# EAGLE schematic bmc (EAGLE 9.6.1)
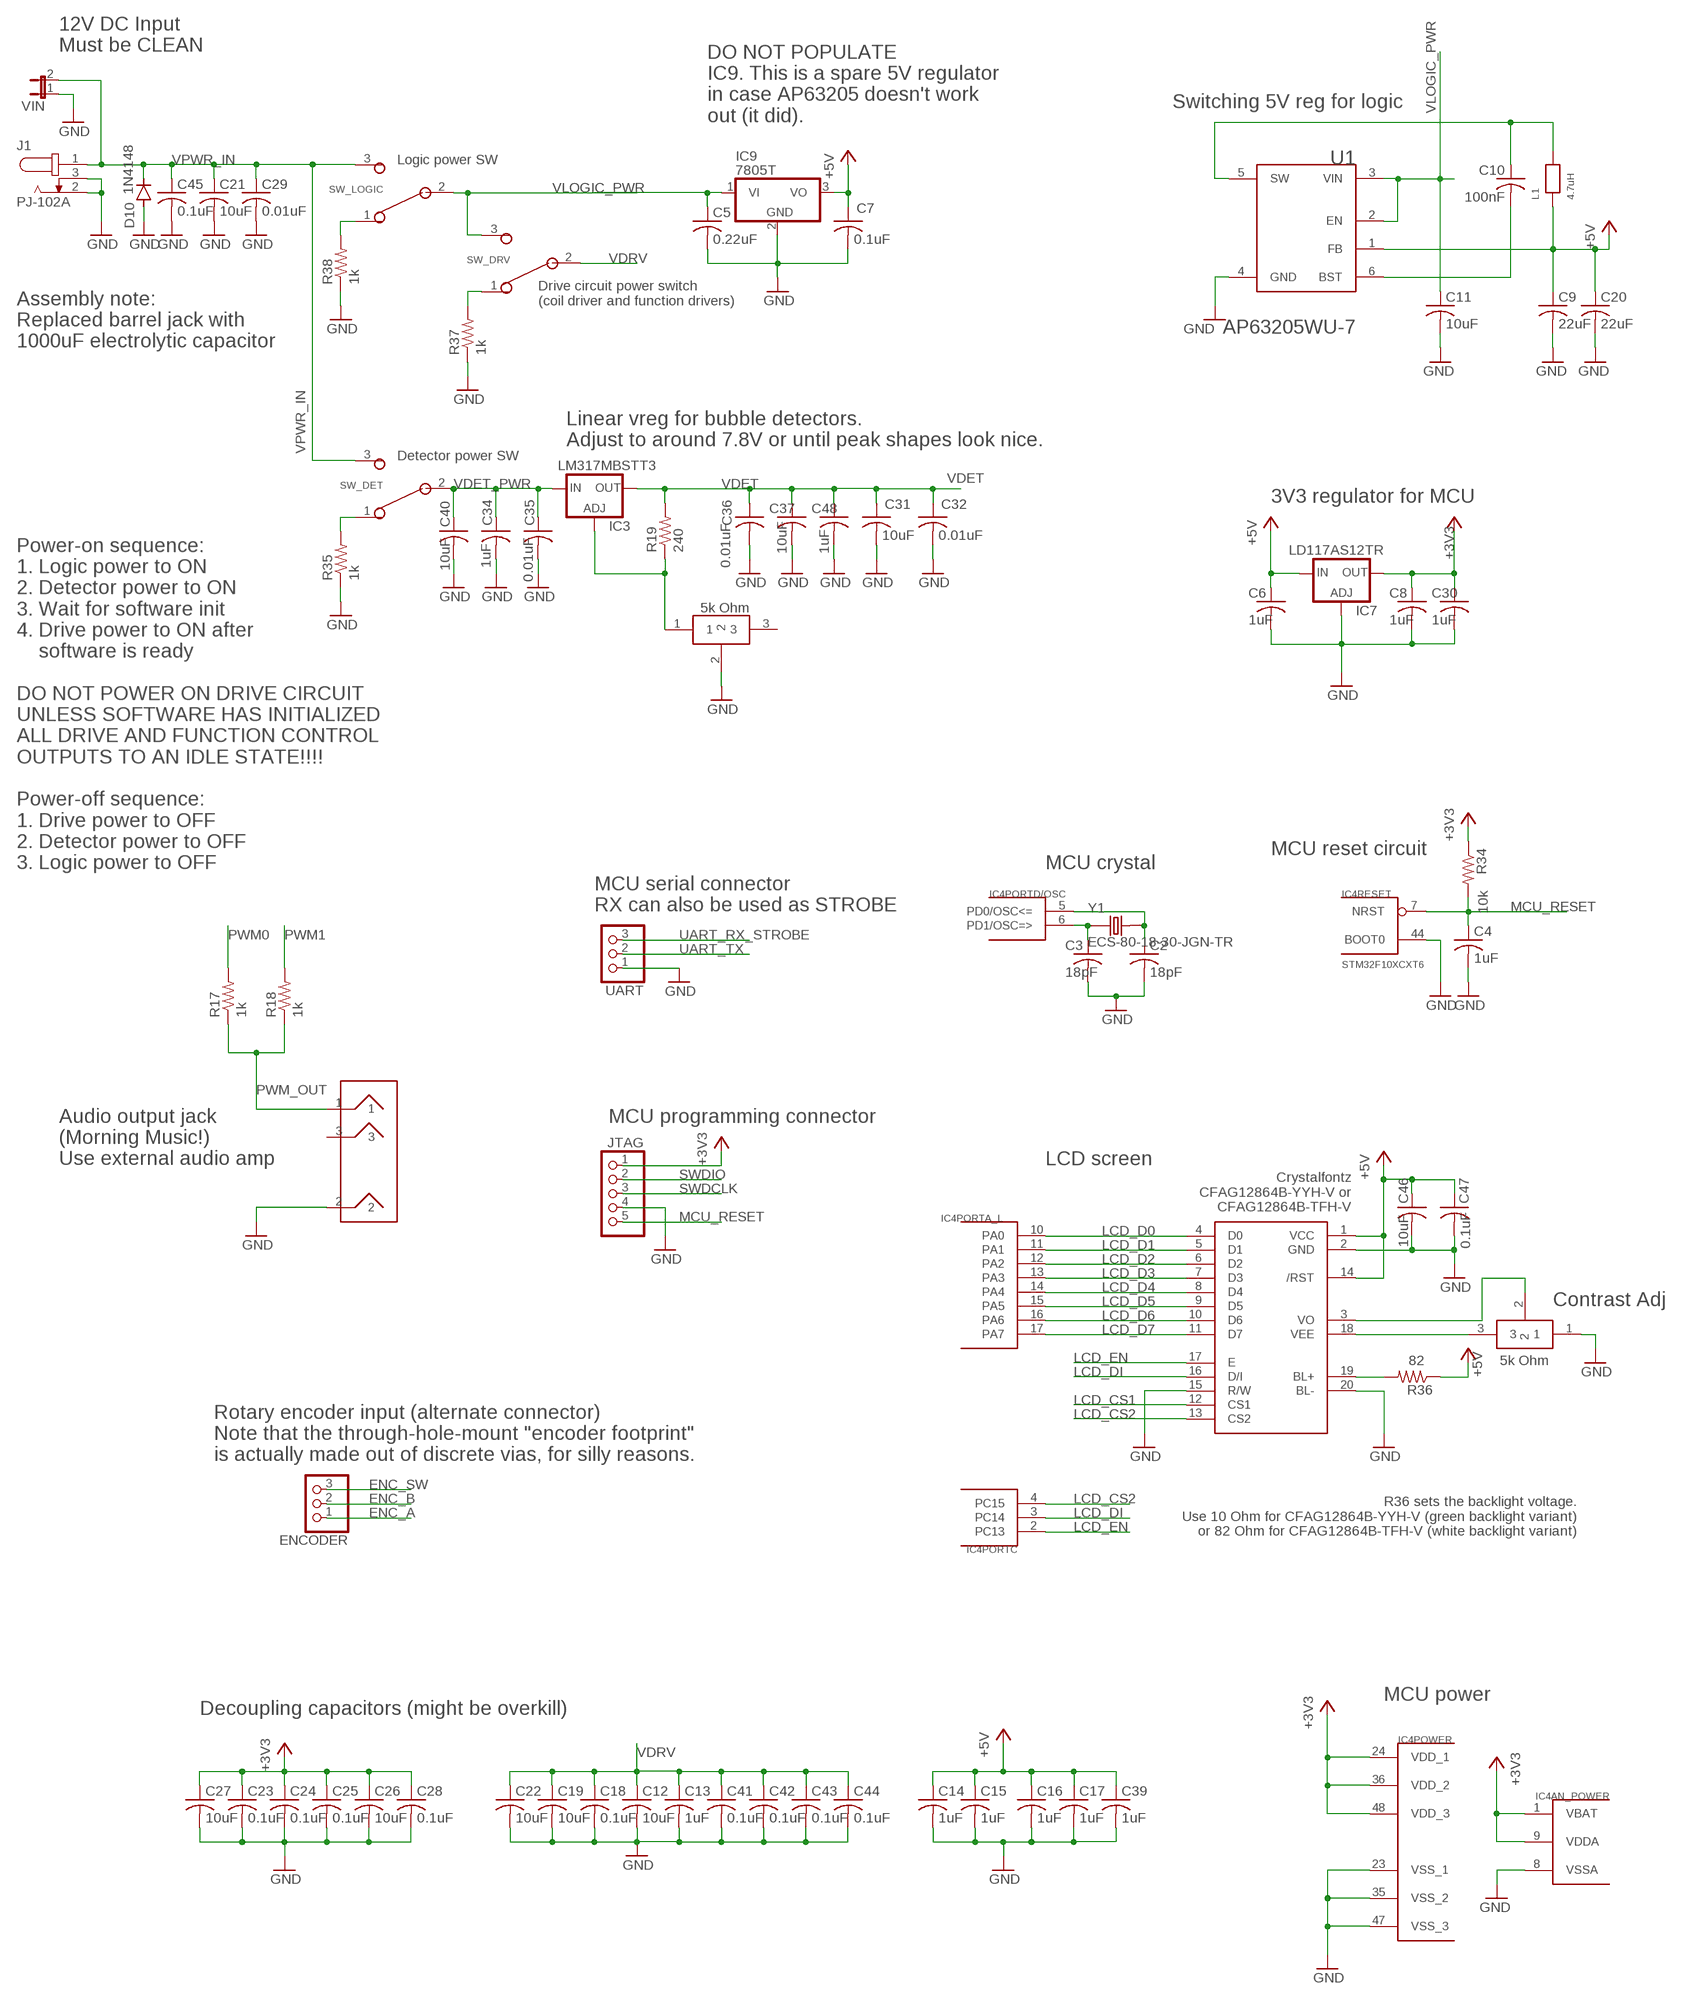
[diagram p0: schematic, sheet 1, part 1 of 2]
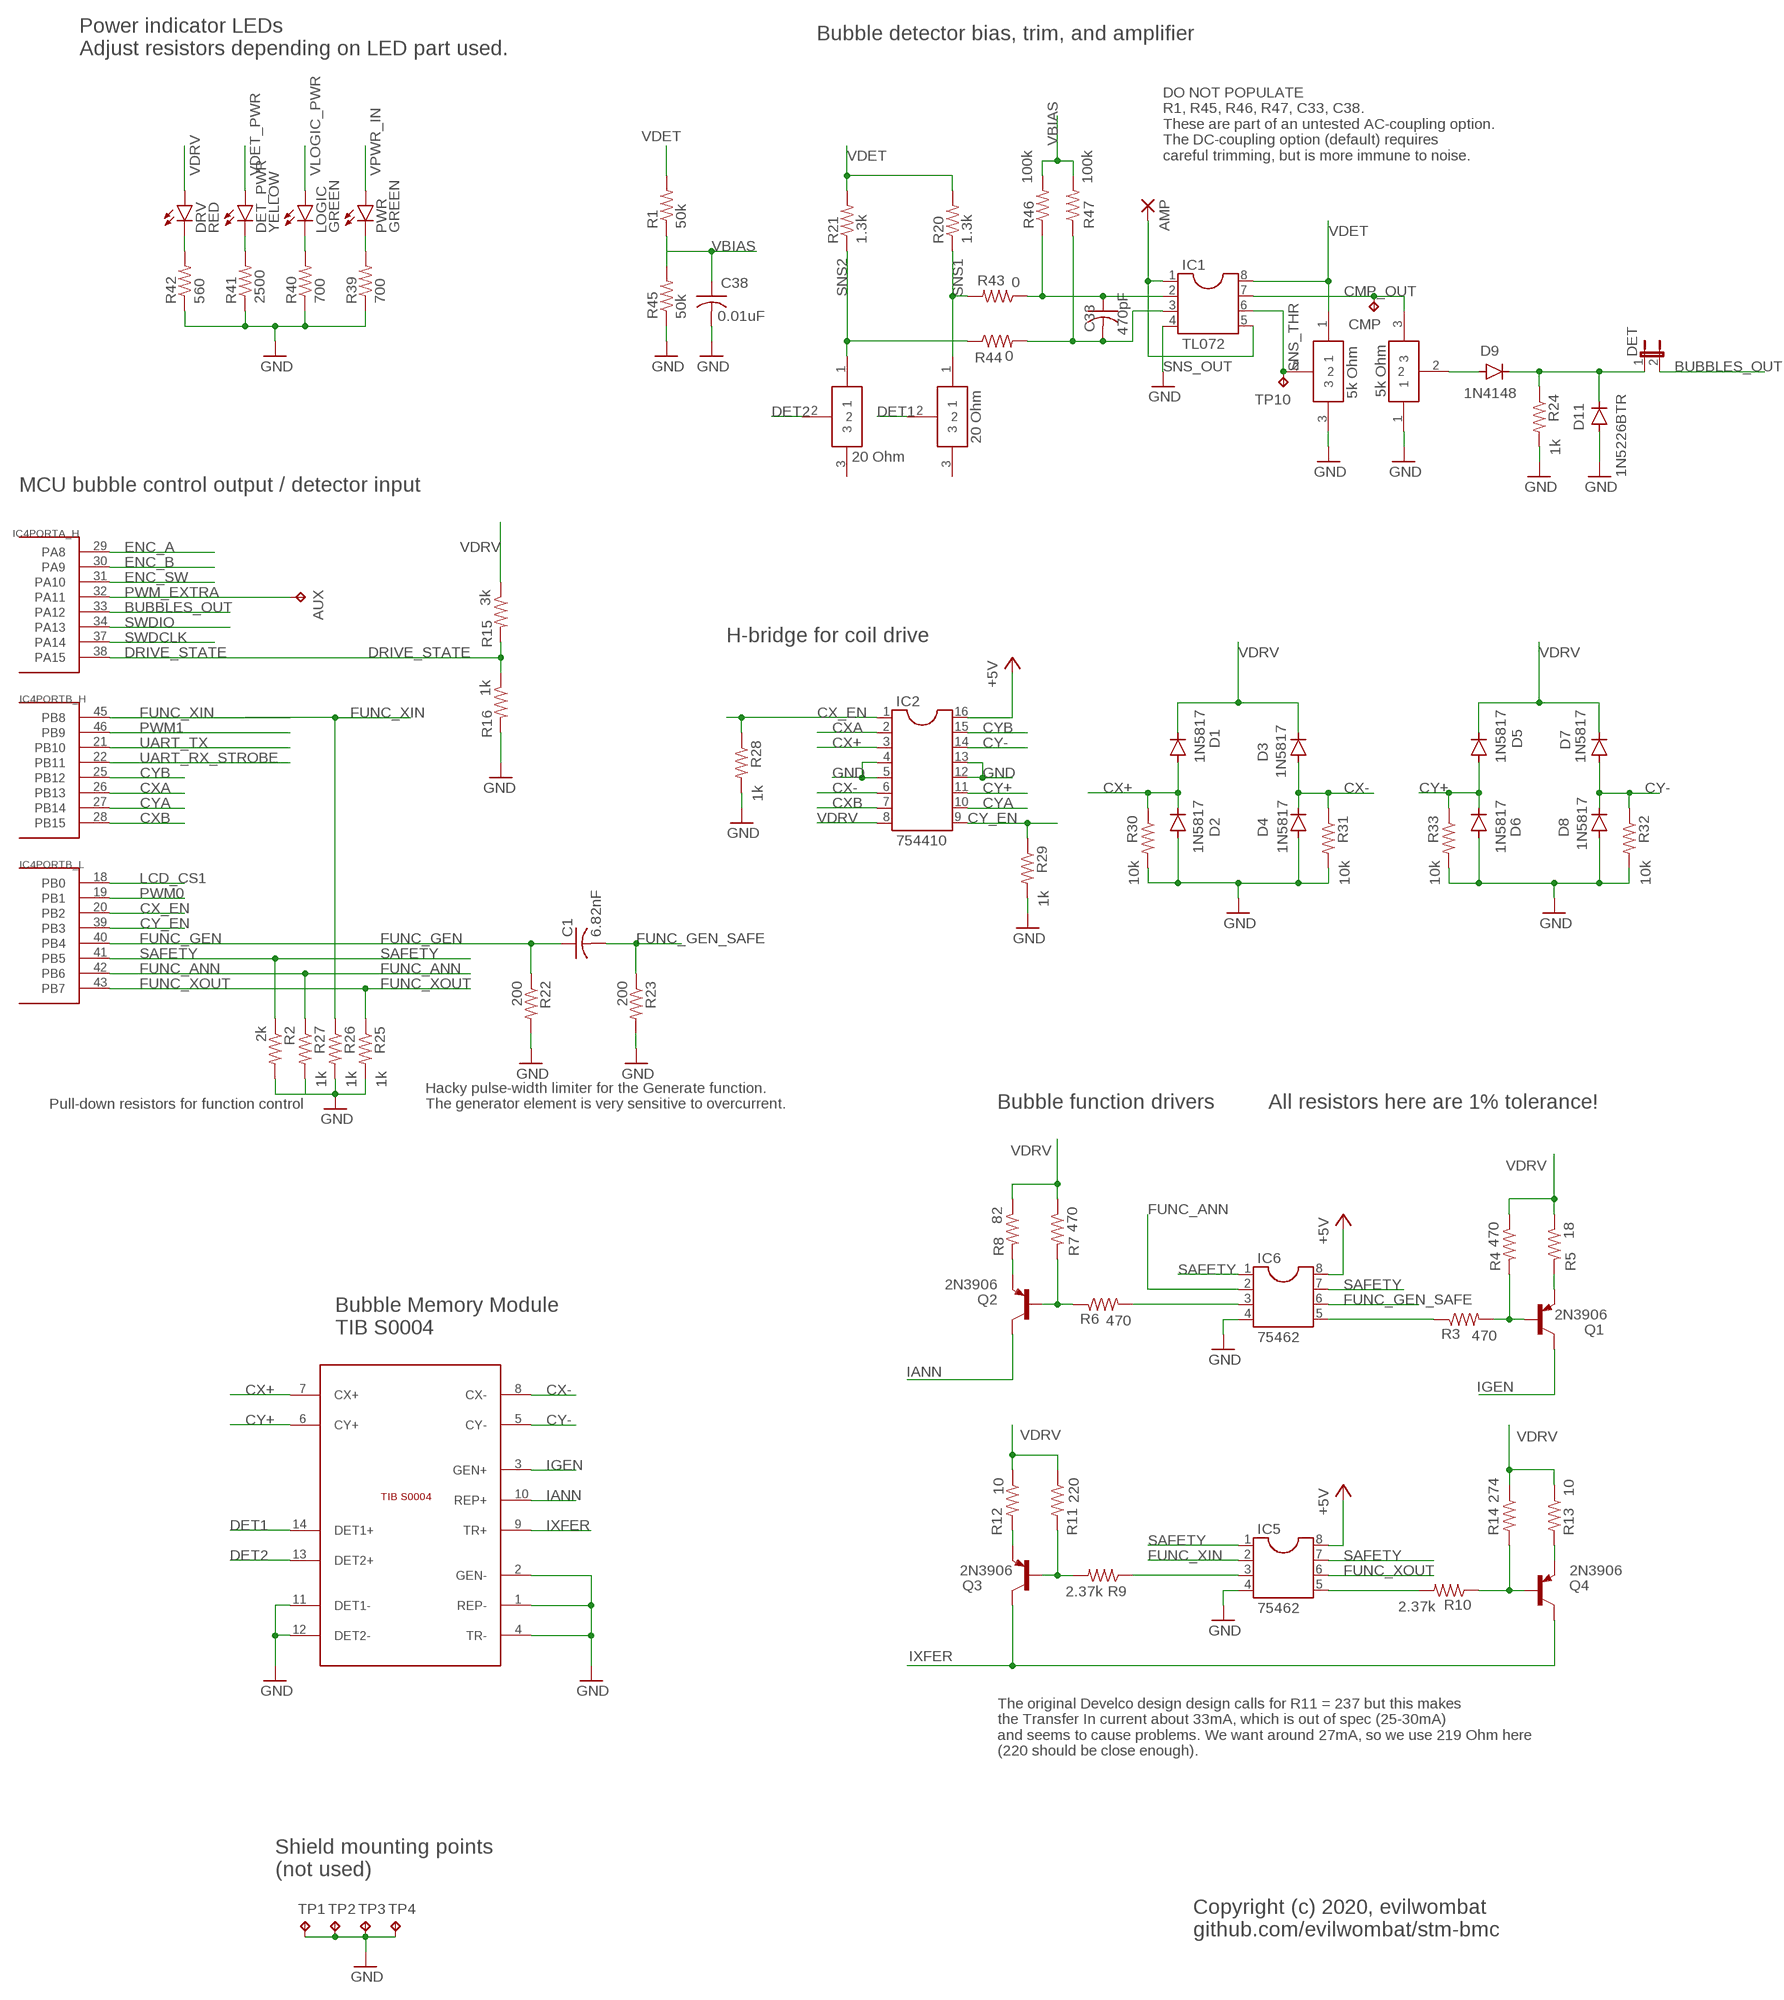
[diagram p1: schematic, sheet 1, part 2 of 2]

## Parts
AMP  1,6/0,8  [1,6/0,8]
AUX  TPTP07R  [TP07R]
C1  6.82nF  C-US_CHIP-0805(2012-METRIC)  [CAPC2012X110]
C2  18pF  C-US_CHIP-0805(2012-METRIC)  [CAPC2012X110]
C3  18pF  C-US_CHIP-0805(2012-METRIC)  [CAPC2012X110]
C4  1uF  C-US_CHIP-0805(2012-METRIC)  [CAPC2012X110]
C5  0.22uF  C-US_CHIP-0805(2012-METRIC)  [CAPC2012X110]
C6  1uF  C-US_CHIP-0805(2012-METRIC)  [CAPC2012X110]
C7  0.1uF  C-US_CHIP-0805(2012-METRIC)  [CAPC2012X110]
C8  1uF  C-US_CHIP-0805(2012-METRIC)  [CAPC2012X110]
C9  22uF  C-US_CHIP-0805(2012-METRIC)  [CAPC2012X110]
C10  100nF  C-US_CHIP-0805(2012-METRIC)  [CAPC2012X110]
C11  10uF  C-US_CHIP-1206(3216-METRIC)  [CAPC3216X135]
C12  10uF  C-US_CHIP-1206(3216-METRIC)  [CAPC3216X135]
C13  1uF  C-US_CHIP-0805(2012-METRIC)  [CAPC2012X110]
C14  1uF  C-US_CHIP-0805(2012-METRIC)  [CAPC2012X110]
C15  1uF  C-US_CHIP-0805(2012-METRIC)  [CAPC2012X110]
C16  1uF  C-US_CHIP-0805(2012-METRIC)  [CAPC2012X110]
C17  1uF  C-US_CHIP-0805(2012-METRIC)  [CAPC2012X110]
C18  0.1uF  C-US_CHIP-0805(2012-METRIC)  [CAPC2012X110]
C19  10uF  C-US_CHIP-1206(3216-METRIC)  [CAPC3216X135]
C20  22uF  C-US_CHIP-0805(2012-METRIC)  [CAPC2012X110]
C21  10uF  C-US_CHIP-1206(3216-METRIC)  [CAPC3216X135]
C22  10uF  C-US_CHIP-1206(3216-METRIC)  [CAPC3216X135]
C23  0.1uF  C-US_CHIP-0402(1005-METRIC)  [CAPC1005X60]
C24  0.1uF  C-US_CHIP-0402(1005-METRIC)  [CAPC1005X60]
C25  0.1uF  C-US_CHIP-0402(1005-METRIC)  [CAPC1005X60]
C26  10uF  C-US_CHIP-0805(2012-METRIC)  [CAPC2012X110]
C27  10uF  C-US_CHIP-0805(2012-METRIC)  [CAPC2012X110]
C28  0.1uF  C-US_CHIP-0402(1005-METRIC)  [CAPC1005X60]
C29  0.01uF  C-US_CHIP-0805(2012-METRIC)  [CAPC2012X110]
C30  1uF  C-US_CHIP-0805(2012-METRIC)  [CAPC2012X110]
C31  10uF  C-US_CHIP-1206(3216-METRIC)  [CAPC3216X135]
C32  0.01uF  C-US_CHIP-0805(2012-METRIC)  [CAPC2012X110]
C33  470pF  C-US_CHIP-0805(2012-METRIC)  [CAPC2012X110]
C34  1uF  C-US_CHIP-0805(2012-METRIC)  [CAPC2012X110]
C35  0.01uF  C-US_CHIP-0805(2012-METRIC)  [CAPC2012X110]
C36  0.01uF  C-US_CHIP-0805(2012-METRIC)  [CAPC2012X110]
C37  10uF  C-US_CHIP-1206(3216-METRIC)  [CAPC3216X135]
C38  0.01uF  C-US_CHIP-0805(2012-METRIC)  [CAPC2012X110]
C39  1uF  C-US_CHIP-0805(2012-METRIC)  [CAPC2012X110]
C40  10uF  C-US_CHIP-1206(3216-METRIC)  [CAPC3216X135]
C41  0.1uF  C-US_CHIP-0805(2012-METRIC)  [CAPC2012X110]
C42  0.1uF  C-US_CHIP-0805(2012-METRIC)  [CAPC2012X110]
C43  0.1uF  C-US_CHIP-0805(2012-METRIC)  [CAPC2012X110]
C44  0.1uF  C-US_CHIP-0805(2012-METRIC)  [CAPC2012X110]
C45  0.1uF  C-US_CHIP-0805(2012-METRIC)  [CAPC2012X110]
C46  10uF  C-US_CHIP-1206(3216-METRIC)  [CAPC3216X135]
C47  0.1uF  C-US_CHIP-0805(2012-METRIC)  [CAPC2012X110]
C48  1uF  C-US_CHIP-0805(2012-METRIC)  [CAPC2012X110]
CMP  TPTP07R  [TP07R]
D1  1N5817  1N4004  [DO-41]
D2  1N5817  1N4004  [DO-41]
D3  1N5817  1N4004  [DO-41]
D4  1N5817  1N4004  [DO-41]
D5  1N5817  1N4004  [DO-41]
D6  1N5817  1N4004  [DO-41]
D7  1N5817  1N4004  [DO-41]
D8  1N5817  1N4004  [DO-41]
D9  1N4148  1N4004  [DO-41]
D10  1N4148  1N4004  [DO-41]
D11  1N5226BTR  1N4004  [DO-41]
DET  JP1E  [JP1]
DET_PWR  YELLOW  LEDCHIPLED_1206  [CHIPLED_1206]
DISP1  CFAG12864B  [CFAG16864B]
DRV  RED  LEDCHIPLED_1206  [CHIPLED_1206]
ENCODER  PINHD-1X3  [1X03]
IC1  TL072  DIL8  [DIL08]
IC2  754410  DIL16  [DIL16]
IC3  LM317MBSTT3  [SOT223]
IC4  STM32F10XCXT6  [TQFP48]
IC5  75462  DIL8  [DIL08]
IC6  75462  DIL8  [DIL08]
IC7  LD117AS12TR  [SOT223]
IC9  7805T  [TO220H]
J1  PJ-102A  [CUI_PJ-102A]
JTAG  PINHD-1X5  [1X05]
L1  4.7uH  IND-10081008  [WE-PMI_1008]
LOGIC  GREEN  LEDCHIPLED_1206  [CHIPLED_1206]
MUSIC_OUT  STX-3501-3N  [STX-3501-3N]
OLVL  PV36W  [PV36W]
PWR  GREEN  LEDCHIPLED_1206  [CHIPLED_1206]
Q1  2N3906  [TO92]
Q2  2N3906  [TO92]
Q3  2N3906  [TO92]
Q4  2N3906  [TO92]
R1  50k  R-US_R0805  [R0805]
R2  2k  R-US_R0805  [R0805]
R3  470  R-US_R0805  [R0805]
R4  470  R-US_R0805  [R0805]
R5  18  R-US_R0805  [R0805]
R6  470  R-US_R0805  [R0805]
R7  470  R-US_R0805  [R0805]
R8  82  R-US_R0805  [R0805]
R9  2.37k  R-US_R0805  [R0805]
R10  2.37k  R-US_R0805  [R0805]
R11  220  R-US_R0805  [R0805]
R12  10  R-US_R0805  [R0805]
R13  10  R-US_R0805  [R0805]
R14  274  R-US_R0805  [R0805]
R15  3k  R-US_R0805  [R0805]
R16  1k  R-US_R0805  [R0805]
R17  1k  R-US_R0805  [R0805]
R18  1k  R-US_R0805  [R0805]
R19  240  R-US_R0805  [R0805]
R20  1.3k  R-US_0204/7  [0204/7]
R21  1.3k  R-US_0204/7  [0204/7]
R22  200  R-US_R0805  [R0805]
R23  200  R-US_R0805  [R0805]
R24  1k  R-US_R0805  [R0805]
R25  1k  R-US_R0805  [R0805]
R26  1k  R-US_R0805  [R0805]
R27  1k  R-US_R0805  [R0805]
R28  1k  R-US_R0805  [R0805]
R29  1k  R-US_R0805  [R0805]
R30  10k  R-US_R0805  [R0805]
R31  10k  R-US_R0805  [R0805]
R32  10k  R-US_R0805  [R0805]
R33  10k  R-US_R0805  [R0805]
R34  10k  R-US_R0805  [R0805]
R35  1k  R-US_R0805  [R0805]
R36  82  R-US_R1206  [R1206]
R37  1k  R-US_R0805  [R0805]
R38  1k  R-US_R0805  [R0805]
R39  700  R-US_R0805  [R0805]
R40  700  R-US_R0805  [R0805]
R41  2500  R-US_R0805  [R0805]
R42  560  R-US_R0805  [R0805]
R43  0  R-US_R0805  [R0805]
R44  0  R-US_R0805  [R0805]
R45  50k  R-US_R0805  [R0805]
R46  100k  R-US_R0805  [R0805]
R47  100k  R-US_R0805  [R0805]
SW_DET  SW_SPDT  [SW_SPDT]
SW_DRV  SW_SPDT  [SW_SPDT]
SW_LOGIC  SW_SPDT  [SW_SPDT]
THR  PV36W  [PV36W]
TP1  TPTP20SQ  [TP20SQ]
TP2  TPTP20SQ  [TP20SQ]
TP3  TPTP20SQ  [TP20SQ]
TP4  TPTP20SQ  [TP20SQ]
TP10  TPTP07R  [TP07R]
TRIM+  PV36W  [PV36W]
TRIM-  20 Ohm  PV36W  [PV36W]
U1  DIODES_INC._AP63205WU-7DIODES_INC._AP63205WU-7_0_3  [DIODES_INC._AP63205WU-7_3]
U$1  TP3386  [3386-EY5]
U$5  TIB_S0004  [MBM]
UART  PINHD-1X3  [1X03]
VDET  PV36W  [PV36W]
VIN  JP1E  [JP1]
Y1  ECS-80-18-30-JGN-TR  [XTAL_ECS-80-18-30-JGN-TR]

## Nets
+3V3: C8.1 C23.1 C24.1 C25.1 C26.1 C27.1 C28.1 C30.1 IC4.1(AN_POWER:VBAT) IC4.9(AN_POWER:VDDA) IC4.24(POWER:VDD_1) IC4.36(POWER:VDD_2) IC4.48(POWER:VDD_3) IC7.4(OUT) JTAG.1 R34.1
+5V: C6.1 C7.1 C9.1 C14.1 C15.1 C16.1 C17.1 C20.1 C39.1 C46.1 C47.1 DISP1.1(VCC) DISP1.14(/RST) IC2.16 IC5.8 IC6.8 IC7.3(IN) IC9.3(VO) L1.1 R36.1 U1.1(FB)
BUBBLES_OUT: DET.2 IC4.33(PORTA_H:PA12)
BUBBLES_OUT_JP: D9.C D11.C DET.1 R24.1
CMP_OUT: CMP.TP IC1.7 OLVL.3
CX+: D1.A D2.C IC2.3 R30.1 U$5.7(CX+)
CX-: D3.A D4.C IC2.6 R31.1 U$5.8(CX-)
CX_EN: IC2.1 IC4.20(PORTB_L:PB2) R28.1
CXA: IC2.2 IC4.26(PORTB_H:PB13)
CXB: IC2.7 IC4.28(PORTB_H:PB15)
CY+: D5.A D6.C IC2.11 R33.1 U$5.6(CY+)
CY-: D7.A D8.C IC2.14 R32.1 U$5.5(CY-)
CY_EN: IC2.9 IC4.39(PORTB_L:PB3) R29.1
CYA: IC2.10 IC4.27(PORTB_H:PB14)
CYB: IC2.15 IC4.25(PORTB_H:PB12)
DET1: TRIM-.2 U$5.14(DET1+)
DET2: TRIM+.2 U$5.13(DET2+)
DRIVE_STATE: IC4.38(PORTA_H:PA15) R15.2 R16.1
ENC_A: ENCODER.1 IC4.29(PORTA_H:PA8)
ENC_B: ENCODER.2 IC4.30(PORTA_H:PA9)
ENC_SW: ENCODER.3 IC4.31(PORTA_H:PA10)
FUNC_ANN: IC4.42(PORTB_L:PB6) IC6.2 R27.1
FUNC_GEN: C1.1 IC4.40(PORTB_L:PB4) R22.1
FUNC_GEN_SAFE: C1.2 IC6.6 R23.1
FUNC_XIN: IC4.45(PORTB_H:PB8) IC5.2 R26.1
FUNC_XOUT: IC4.43(PORTB_L:PB7) IC5.6 R25.1
GND: C2.2 C3.2 C4.2 C5.2 C6.2 C7.2 C8.2 C9.2 C11.2 C12.2 C13.2 C14.2 C15.2 C16.2 C17.2 C18.2 C19.2 C20.2 C21.2 C22.2 C23.2 C24.2 C25.2 C26.2 C27.2 C28.2 C29.2 C30.2 C31.2 C32.2 C34.2 C35.2 C36.2 C37.2 C38.2 C39.2 C40.2 C41.2 C42.2 C43.2 C44.2 C45.2 C46.2 C47.2 C48.2 D2.A D4.A D6.A D8.A D10.A D11.A DISP1.2(GND) DISP1.15(R/W) DISP1.20(BL-) IC1.4 IC2.4 IC2.5 IC2.12 IC2.13 IC4.8(AN_POWER:VSSA) IC4.23(POWER:VSS_1) IC4.35(POWER:VSS_2) IC4.44(RESET:BOOT0) IC4.47(POWER:VSS_3) IC5.4 IC6.4 IC7.1(ADJ) IC9.2(GND) J1.2 J1.3 JTAG.4 MUSIC_OUT.2 OLVL.1 R2.2 R16.2 R22.2 R23.2 R24.2 R25.2 R26.2 R27.2 R28.2 R29.2 R30.2 R31.2 R32.2 R33.2 R35.1 R37.1 R38.1 R39.1 R40.1 R41.1 R42.1 R45.1 THR.3 TP1.TP TP2.TP TP3.TP TP4.TP U1.4(GND) U$1.1 U$5.1(REP-) U$5.2(GEN-) U$5.4(TR-) U$5.11(DET1-) U$5.12(DET2-) UART.1 VDET.2 VIN.1
IANN: Q2.1(C) U$5.10(REP+)
IGEN: Q1.1(C) U$5.3(GEN+)
IXFER: Q3.1(C) Q4.1(C) U$5.9(TR+)
LCD_BL+: DISP1.19(BL+) R36.2
LCD_CS1: DISP1.12(CS1) IC4.18(PORTB_L:PB0)
LCD_CS2: DISP1.13(CS2) IC4.4(PORTC:PC15)
LCD_D0: DISP1.4(D0) IC4.10(PORTA_L:PA0)
LCD_D1: DISP1.5(D1) IC4.11(PORTA_L:PA1)
LCD_D2: DISP1.6(D2) IC4.12(PORTA_L:PA2)
LCD_D3: DISP1.7(D3) IC4.13(PORTA_L:PA3)
LCD_D4: DISP1.8(D4) IC4.14(PORTA_L:PA4)
LCD_D5: DISP1.9(D5) IC4.15(PORTA_L:PA5)
LCD_D6: DISP1.10(D6) IC4.16(PORTA_L:PA6)
LCD_D7: DISP1.11(D7) IC4.17(PORTA_L:PA7)
LCD_DI: DISP1.16(D/I) IC4.3(PORTC:PC14)
LCD_EN: DISP1.17(E) IC4.2(PORTC:PC13)
LCD_VEE: DISP1.18(VEE) U$1.3
LCD_VO: DISP1.3(VO) U$1.2
MCU_RESET: C4.1 IC4.7(RESET:NRST) JTAG.5 R34.2
N$1: C3.1 IC4.6(PORTD/OSC:PD1/OSC=>) Y1.1(IN/OUT)
N$2: C2.1 IC4.5(PORTD/OSC:PD0/OSC<=) Y1.2(OUT/IN)
N$3: D9.A OLVL.2
N$4: C33.2 IC1.3 R44.2 R47.1
N$5: Q1.2(B) R3.2 R4.2
N$6: IC6.5 R3.1
N$7: Q1.3(E) R5.2
N$8: IC6.3 R6.2
N$9: Q2.2(B) R6.1 R7.2
N$10: IC5.3 R9.1
N$11: Q2.3(E) R8.2
N$12: IC5.5 R10.2
N$13: Q3.3(E) R12.2
N$14: Q3.2(B) R9.2 R11.2
N$15: Q4.2(B) R10.1 R14.2
N$16: Q4.3(E) R13.2
N$17: C33.1 IC1.2 R43.1 R46.1
N$18: IC3.1(ADJ) R19.1 VDET.1
N$20: R35.2 SW_DET.1(NC)
N$21: R37.2 SW_DRV.1(NC)
N$22: R38.2 SW_LOGIC.1(NC)
N$24: C10.1 L1.2 U1.5(SW)
N$25: PWR.C R39.2
N$26: LOGIC.C R40.2
N$27: DET_PWR.C R41.2
N$31: DRV.C R42.2
N$38: C10.2 U1.6(BST)
PWM0: IC4.19(PORTB_L:PB1) R17.2
PWM1: IC4.46(PORTB_H:PB9) R18.2
PWM_EXTRA: AUX.TP IC4.32(PORTA_H:PA11)
PWM_OUT: MUSIC_OUT.1 R17.1 R18.1
SAFETY: IC4.41(PORTB_L:PB5) IC5.1 IC5.7 IC6.1 IC6.7 R2.1
SNS1: R20.1 R43.2 TRIM-.1
SNS2: R21.1 R44.1 TRIM+.1
SNS_OUT: AMP.1(P) IC1.1 IC1.5
SNS_THR: IC1.6 THR.2 TP10.TP
SWDCLK: IC4.37(PORTA_H:PA14) JTAG.3
SWDIO: IC4.34(PORTA_H:PA13) JTAG.2
UART_RX_STROBE: IC4.22(PORTB_H:PB11) UART.3
UART_TX: IC4.21(PORTB_H:PB10) UART.2
VBIAS: C38.1 R1.1 R45.2 R46.2 R47.2
VDET: C31.1 C32.1 C36.1 C37.1 C48.1 IC1.8 IC3.2(OUT) IC3.4(OUT) R1.2 R19.2 R20.2 R21.2 THR.1
VDET_PWR: C34.1 C35.1 C40.1 DET_PWR.A IC3.3(IN) SW_DET.2(COM)
VDRV: C12.1 C13.1 C18.1 C19.1 C22.1 C41.1 C42.1 C43.1 C44.1 D1.C D3.C D5.C D7.C DRV.A IC2.8 R4.1 R5.1 R7.1 R8.1 R11.1 R12.1 R13.1 R14.1 R15.1 SW_DRV.2(COM)
VLOGIC_PWR: C5.1 C11.1 IC9.1(VI) LOGIC.A SW_DRV.3(NO) SW_LOGIC.2(COM) U1.2(EN) U1.3(VIN)
VPWR_IN: C21.1 C29.1 C45.1 D10.C J1.1 PWR.A SW_DET.3(NO) SW_LOGIC.3(NO) VIN.2
Unconnected: MUSIC_OUT.3 TRIM+.3 TRIM-.3 VDET.3

## Notes on the sheet
- 12V DC Input
  Must be CLEAN
- Switching 5V reg for logic
- DO NOT POPULATE
  IC9. This is a spare 5V regulator
  in case AP63205 doesn't work
  out (it did).
- Bubble detector bias, trim, and amplifier
- Power indicator LEDs
  Adjust resistors depending on LED part used.
- Logic power SW
- DO NOT POPULATE
  R1, R45, R46, R47, C33, C38.
  These are part of an untested AC-coupling option.
  The DC-coupling option (default) requires
  careful trimming, but is more immune to noise.
- Drive circuit power switch
  (coil driver and function drivers)
- Assembly note:
  Replaced barrel jack with
  1000uF electrolytic capacitor
- Linear vreg for bubble detectors.
  Adjust to around 7.8V or until peak shapes look nice.
- 5k Ohm | 5k Ohm
- Detector power SW
- 3V3 regulator for MCU | 20 Ohm
- 20 Ohm
- MCU bubble control output / detector input
- 5k Ohm
- H-bridge for coil drive
- MCU reset circuit
- Power-on sequence:
  1. Logic power to ON
  2. Detector power to ON
  3. Wait for software init
  4. Drive power to ON after
      software is ready
  
  DO NOT POWER ON DRIVE CIRCUIT
  UNLESS SOFTWARE HAS INITIALIZED
  ALL DRIVE AND FUNCTION CONTROL
  OUTPUTS TO AN IDLE STATE!!!!
  
  Power-off sequence:
  1. Drive power to OFF
  2. Detector power to OFF
  3. Logic power to OFF
- MCU crystal
- MCU serial connector
  RX can also be used as STROBE
- MCU programming connector | Pull-down resistors for function control
- Hacky pulse-width limiter for the Generate function.
  The generator element is very sensitive to overcurrent.
- Bubble function drivers | All resistors here are 1% tolerance!
- Audio output jack
  (Morning Music!)
  Use external audio amp
- LCD screen
- Crystalfontz
  CFAG12864B-YYH-V or
  CFAG12864B-TFH-V
- Contrast Adj
- Bubble Memory Module
  TIB S0004
- 5k Ohm
- Rotary encoder input (alternate connector)
  Note that the through-hole-mount "encoder footprint"
  is actually made out of discrete vias, for silly reasons.
- R36 sets the backlight voltage.
  Use 10 Ohm for CFAG12864B-YYH-V (green backlight variant)
  or 82 Ohm for CFAG12864B-TFH-V (white backlight variant)
- MCU power
- Decoupling capacitors (might be overkill)
- The original Develco design design calls for R11 = 237 but this makes
  the Transfer In current about 33mA, which is out of spec (25-30mA)
  and seems to cause problems. We want around 27mA, so we use 219 Ohm here 
  (220 should be close enough).
- Shield mounting points
  (not used)
- Copyright (c) 2020, evilwombat
  github.com/evilwombat/stm-bmc

## Library data of the parts
AMP = wirepad:1,6/0,8: THROUGH-HOLE PAD
AUX CMP TP1-TP4 TP10 = testpad:TP: Test pad
C1-C48 = Capacitor:C-US: Capacitor - ANSI; CATEGORY: Capacitor
D1-D11 = Diodes:1N4004: DIODE GEN PURP 400V 1A DO41 Manufacturer's datasheet <https://www.mccsemi.com/pdf/Products/1N4001-1N4007(DO-41).pdf>; CREATED_BY: PCBLayout.com; DIGIKEY_PART_NUMBER: 1N4004MSCT-ND; MANUFACTURER: Micro Commercial Co; MPN: 1N4004; PACKAGE: DO-41
DET VIN = jumper:JP1E: JUMPER
DET_PWR DRV LOGIC PWR = led:LED: LED OSRAM: - CHIPLED LG R971, LG N971, LY N971, LG Q971, LY Q971, LO R971, LY R971 LH N974, LH R974 LS Q976, LO Q976, LY Q976 LO Q996 - Hyper CHIPLED LW Q18S LB Q993, LB Q99A, LB R99A - SideLED LS A670, LO A670, LY A670, LG A670, LP A670 LB A673, LV A673, LT A673, LW A673 LH A674 LY A675 LS A676, LA A676, LO A676, LY A676, LW A676 LS A679, LY A679, LG A679 - Hyper Micro SIDELED® LS Y876, LA Y876, LO Y876, LY Y876 LT Y87S - SmartLED LW L88C, LW L88S LB L89C, LB L89S, LG L890 LS L89K, LO L89K, LY L89K LS L896, LA L896, LO L896, LY L896 - TOPLED LS T670, LO T670, LY T670, LG T670, LP T670 LSG T670, LSP T670, LSY T670, LOP T670, LYG T670 LG T671, LOG T671, LSG T671 LB T673, LV T673, LT T673, LW T673 LH T674 LS T676, LA T676, LO T676, LY T676, LB T676, LH T676, LSB T676, LW T676 LB T67C, LV T67C, LT T67C, LS T67K, LO T67K, LY T67K, LW E67C LS E67B, LA E67B, LO E67B, LY E67B, LB E67C, LV E67C, LT E67C LW T67C LS T679, LY T679, LG T679 LS T770, LO T770, LY T770, LG T770, LP T770 LB T773, LV T773, LT T773, LW T773 LH T774 LS E675, LA E675, LY E675, LS T675 LS T776, LA T776, LO T776, LY T776, LB T776 LHGB T686 LT T68C, LB T68C - Hyper Mini TOPLED® LB M676 - Mini TOPLED Santana® LG M470 LS M47K, LO M47K, LY M47K Source: http://www.osram.convergy.de LUXEON: - LUMILED® LXK2-PW12-R00, LXK2-PW12-S00, LXK2-PW14-U00, LXK2-PW14-V00 LXK2-PM12-R00, LXK2-PM12-S00, LXK2-PM14-U00 LXK2-PE12-Q00, LXK2-PE12-R00, LXK2-PE12-S00, LXK2-PE14-T00, LXK2-PE14-U00 LXK2-PB12-K00, LXK2-PB12-L00, LXK2-PB12-M00, LXK2-PB14-N00, LXK2-PB14-P00, LXK2-PB14-Q00 LXK2-PR12-L00, LXK2-PR12-M00, LXK2-PR14-Q00, LXK2-PR14-R00 LXK2-PD12-Q00, LXK2-PD12-R00, LXK2-PD12-S00 LXK2-PH12-R00, LXK2-PH12-S00 LXK2-PL12-P00, LXK2-PL12-Q00, LXK2-PL12-R00 Source: www.luxeon.com KINGBRIGHT: KA-3528ASYC Source: www.kingbright.com
DISP1 = bmc:CFAG12864B
ENCODER UART = pinhead:PINHD-1X3: PIN HEADER
IC1 IC5 IC6 = ic-package:DIL8: Dual In Line / Socket
IC2 = ic-package:DIL16: Dual In Line / Socket
IC3 = myvreg:LM317?*: 500 mA Adjustable Output Positive Voltage Regulator Source: http://www.onsemi.co.jp .. LM317M-D.PDF
IC4 = stm32:STM32F10XCXT6: ST STM32F101/103 48pin LQFP
IC7 = v-reg:LD117A?*: Low drop fixed and adjustable positive voltage regulators 1 A Source: http://www.st.com/stonline/products/literature/ds/7194/ld1117axx.pdf
IC9 = linear:78*: Positive VOLTAGE REGULATOR Source: http://cache.national.com/ds/LM/LM78L05.pdf http://www.fairchildsemi.com/ds/LM/LM7805.pdf
J1 = PJ-102A:PJ-102A: 2.0 mm Center Pin, 2.5 A, Right Angle, Through Hole, Tapered Pins, Dc Power Jack Connector; MANUFACTURER: CUI INC; PART_REV: 1.03; STANDARD: Manufacturer recommendations
JTAG = pinhead:PINHD-1X5: PIN HEADER
L1 = bmc:IND-1008
MUSIC_OUT = bmc:STX-3501-3N
OLVL THR TRIM+ TRIM- VDET = bmc:PV36W
Q1-Q4 = transistor-pnp:2N3906: PNP Transistor
R1-R47 = resistor:R-US_: RESISTOR, American symbol
SW_DET SW_DRV SW_LOGIC = bmc:SW_SPDT
U1 = Diodes Inc. - AP63205WU-7:DIODES_INC._AP63205WU-7: Buck Switching Regulator IC Positive Fixed 5V 1 Output 2A SOT-23-6 Thin, TSOT-23-6; AMBIENT_TEMPERATURE_RANGE_HIGH: +85°C; AMBIENT_TEMPERATURE_RANGE_LOW: -40°C; AUTOMOTIVE: No; CENTROID_NOT_SPECIFIED: No; DATASHEET: https://www.diodes.com/assets/Datasheets/AP63200-AP63201-AP63203-AP63205.pdf; DEVICE_CLASS_L1: Integrated Circuits (ICs); DEVICE_CLASS_L2: Power Management ICs; DEVICE_CLASS_L3: Voltage Regulators - Switching; DIGIKEY_DESCRIPTION: IC REG BUCK 5V 2A TSOT26; DIGIKEY_PART_NUMBER: AP63205WU-7DICT-ND; FOOTPRINT_PARAMETERS_0: {"fp_type":"TSOT","params":{"N":{"default":"6","long name":"Number of leads","type":"multichoice","short name":"N"},"A":{"nom":false,"long name":"Height","min":false,"max":1000000,"short name":"A","type":"measurement"},"A1":{"nom":false,"long name":"Package clearance","min":10000,"max":100000,"short name":"A1","type":"measurement"},"A2":{"nom":false,"long name":"Package height","min":840000,"max":900000,"short name":"A2","type":"measurement"},"E":{"nom":2800000,"long name":"Width /w leads","min":false,"max":false,"short name":"E","type":"measurement"},"E1":{"nom":1600000,"long name":"Package width","min":1500000,"max":1700000,"short name":"E1","type":"measurement"},"D":{"nom":2900000,"long name":"Package length","min":2800000,"max":3000000,"short name":"D","type":"measurement"},"B":{"nom":false,"long name":"Lead width","min":300000,"max":450000,"short name":"B","type":"measurement"},"C":{"nom":false,"long name":"Lead thickness","min":120000,"max":200000,"short name":"C","type":"measurement"},"L":{"nom":false,"long name":"Lead foot length","min":300000,"max":500000,"short name":"L","type":"measurement"},"e":{"nom":950000,"long name":"Lead pitch","min":null,"max":null,"short name":"e","type":"measurement"},"PHI":{"nom":4,"long name":"Lead angle","min":0,"max":8,"short name":"PHI","type":"measurement"},"offset x":{"nom":0,"long name":"X Center offset","min":null,"max":null,"short name":"offset x","type":"measurement"},"offset y":{"nom":0,"long name":"Y Center offset","min":null,"max":null,"short name":"offset y","type":"measurement"},"LS":{"default":"Rounded rectangle","long name":"Land shape","type":"multichoice","short name":"LS"},"LS1":{"default":"Rectangle","long name":"Land shape (Pin 1)","type":"multichoice","short name":"LS1"},"solder toe":{"nom":550000,"long name":"Solder fillet (toe)","min":null,"max":null,"short name":"solder toe","type":"fixedmeasurement"},"solder heel":{"nom":450000,"long name":"Solder fillet (heel)","min":null,"max":null,"short name":"solder heel","type":"fixedmeasurement"},"solder side":{"nom":50000,"long name":"Solder fillet (side)","min":null,"max":null,"short name":"solder side","type":"fixedmeasurement"},"courtyard":{"nom":500000,"long name":"Courtyard","min":null,"max":null,"short name":"courtyard","type":"fixedmeasurement"},"SF":{"default":"A","long name":"Packing level","type":"multichoiceparent","short name":"SF","help":"http://support.upverter.com/customer/portal/articles/978783-what-is-a-footprint-packing-level","children":["solder toe","solder heel","solder side","courtyard"]}}}; FOOTPRINT_PARAMETERS_2: {"fp_type":"TSOT","params":{"N":{"default":"6","long name":"Number of leads","type":"multichoice","short name":"N"},"A":{"nom":false,"long name":"Height","min":false,"max":1000000,"short name":"A","type":"measurement"},"A1":{"nom":false,"long name":"Package clearance","min":10000,"max":100000,"short name":"A1","type":"measurement"},"A2":{"nom":false,"long name":"Package height","min":840000,"max":900000,"short name":"A2","type":"measurement"},"E":{"nom":2800000,"long name":"Width /w leads","min":false,"max":false,"short name":"E","type":"measurement"},"E1":{"nom":1600000,"long name":"Package width","min":1500000,"max":1700000,"short name":"E1","type":"measurement"},"D":{"nom":2900000,"long name":"Package length","min":2800000,"max":3000000,"short name":"D","type":"measurement"},"B":{"nom":false,"long name":"Lead width","min":300000,"max":450000,"short name":"B","type":"measurement"},"C":{"nom":false,"long name":"Lead thickness","min":120000,"max":200000,"short name":"C","type":"measurement"},"L":{"nom":false,"long name":"Lead foot length","min":300000,"max":500000,"short name":"L","type":"measurement"},"e":{"nom":950000,"long name":"Lead pitch","min":null,"max":null,"short name":"e","type":"measurement"},"PHI":{"nom":4,"long name":"Lead angle","min":0,"max":8,"short name":"PHI","type":"measurement"},"offset x":{"nom":0,"long name":"X Center offset","min":null,"max":null,"short name":"offset x","type":"measurement"},"offset y":{"nom":0,"long name":"Y Center offset","min":null,"max":null,"short name":"offset y","type":"measurement"},"LS":{"default":"Rounded rectangle","long name":"Land shape","type":"multichoice","short name":"LS"},"LS1":{"default":"Rectangle","long name":"Land shape (Pin 1)","type":"multichoice","short name":"LS1"},"solder toe":{"nom":350000,"long name":"Solder fillet (toe)","min":null,"max":null,"short name":"solder toe","type":"fixedmeasurement"},"solder heel":{"nom":350000,"long name":"Solder fillet (heel)","min":null,"max":null,"short name":"solder heel","type":"fixedmeasurement"},"solder side":{"nom":30000,"long name":"Solder fillet (side)","min":null,"max":null,"short name":"solder side","type":"fixedmeasurement"},"courtyard":{"nom":250000,"long name":"Courtyard","min":null,"max":null,"short name":"courtyard","type":"fixedmeasurement"},"SF":{"default":"B","long name":"Packing level","type":"multichoiceparent","short name":"SF","help":"http://support.upverter.com/customer/portal/articles/978783-what-is-a-footprint-packing-level","children":["solder toe","solder heel","solder side","courtyard"]}}}; FOOTPRINT_PARAMETERS_3: {"fp_type":"TSOT","params":{"N":{"default":"6","long name":"Number of leads","type":"multichoice","short name":"N"},"A":{"nom":false,"long name":"Height","min":false,"max":1000000,"short name":"A","type":"measurement"},"A1":{"nom":false,"long name":"Package clearance","min":10000,"max":100000,"short name":"A1","type":"measurement"},"A2":{"nom":false,"long name":"Package height","min":840000,"max":900000,"short name":"A2","type":"measurement"},"E":{"nom":2800000,"long name":"Width /w leads","min":false,"max":false,"short name":"E","type":"measurement"},"E1":{"nom":1600000,"long name":"Package width","min":1500000,"max":1700000,"short name":"E1","type":"measurement"},"D":{"nom":2900000,"long name":"Package length","min":2800000,"max":3000000,"short name":"D","type":"measurement"},"B":{"nom":false,"long name":"Lead width","min":300000,"max":450000,"short name":"B","type":"measurement"},"C":{"nom":false,"long name":"Lead thickness","min":120000,"max":200000,"short name":"C","type":"measurement"},"L":{"nom":false,"long name":"Lead foot length","min":300000,"max":500000,"short name":"L","type":"measurement"},"e":{"nom":950000,"long name":"Lead pitch","min":null,"max":null,"short name":"e","type":"measurement"},"PHI":{"nom":4,"long name":"Lead angle","min":0,"max":8,"short name":"PHI","type":"measurement"},"offset x":{"nom":0,"long name":"X Center offset","min":null,"max":null,"short name":"offset x","type":"measurement"},"offset y":{"nom":0,"long name":"Y Center offset","min":null,"max":null,"short name":"offset y","type":"measurement"},"LS":{"default":"Rounded rectangle","long name":"Land shape","type":"multichoice","short name":"LS"},"LS1":{"default":"Rectangle","long name":"Land shape (Pin 1)","type":"multichoice","short name":"LS1"},"solder toe":{"nom":150000,"long name":"Solder fillet (toe)","min":null,"max":null,"short name":"solder toe","type":"fixedmeasurement"},"solder heel":{"nom":250000,"long name":"Solder fillet (heel)","min":null,"max":null,"short name":"solder heel","type":"fixedmeasurement"},"solder side":{"nom":10000,"long name":"Solder fillet (side)","min":null,"max":null,"short name":"solder side","type":"fixedmeasurement"},"courtyard":{"nom":100000,"long name":"Courtyard","min":null,"max":null,"short name":"courtyard","type":"fixedmeasurement"},"SF":{"default":"C","long name":"Packing level","type":"multichoiceparent","short name":"SF","help":"http://support.upverter.com/customer/portal/articles/978783-what-is-a-footprint-packing-level","children":["solder toe","solder heel","solder side","courtyard"]}}}; FOOTPRINT_URL: https://www.diodes.com/assets/Package-Files/TSOT26.pdf; FOOTPRINT_VARIANT_NAME_0: Recommended_Land_Pattern; FOOTPRINT_VARIANT_NAME_1: IPC_A; FOOTPRINT_VARIANT_NAME_2: IPC_B; FOOTPRINT_VARIANT_NAME_3: IPC_C; HEIGHT: 1mm; LEAD_FREE: Yes; MAX_DUTY_CYCLE: 100%; MAX_JUNCTION_TEMP: +160°C; MAX_SUPPLY_VOLTAGE: 32V; MF: Diodes Inc.; MFG_PACKAGE_IDENT: TSOT26; MFG_PACKAGE_IDENT_COMPONENT_ID: 08b6807e56fde519; MFG_PACKAGE_IDENT_DATE: 04/2017; MFG_PACKAGE_IDENT_REV: 0; MIN_SUPPLY_VOLTAGE: 3.8V; MOUSER_PART_NUMBER: 621-AP63205WU-7; MPN: AP63205WU-7; NOMINAL_SUPPLY_CURRENT: 22uA; NUMBER_OF_OUTPUTS: 1; OUTPUT_CURRENT: 2A; OUTPUT_TYPE: Fixed; OUTPUT_VOLTAGE: 5V; PACKAGE: TSOT-23-6; PREFIX: U; ROHS: Yes; STANDOFF_HEIGHT: 0.01mm; SWITCHING_FREQUENCY: 1100kHz; SWITCHING_TOPOLOGY: Buck; TEMPERATURE_RANGE_HIGH: +85°C; TEMPERATURE_RANGE_LOW: -40°C; VERIFICATION_VERSION: 0.0.0.3
U$1 = bmc:TP3386
U$5 = bmc:TIB_S0004: TI Bubble Memory Module TIB S0004 TBM 0203 (probably) TBM 0101 (probably) If someone actually does a design with these, drop me a line.
Y1 = ECS-80-18-30-JGN-TR:ECS-80-18-30-JGN-TR: SMD Crystal with a 3.2 x 5 mm footprint; ARROW_ELECTRONICS-PURCHASE-URL: https://snapeda.com/shop?store=Arrow+Electronics&id=2121425; DESCRIPTION: 8MHz ±20ppm Crystal 18pF 100 Ohms 2-SMD, No Lead; DIGI-KEY_PART_NUMBER: XC2103CT-ND; DIGIKEY-PURCHASE-URL: https://snapeda.com/shop?store=DigiKey&id=2121425; MF: ECS Inc.; MOUSER-PURCHASE-URL: https://snapeda.com/shop?store=Mouser&id=2121425; MP: ECS-80-18-30-JGN-TR; PACKAGE: SMD-2 ECS International